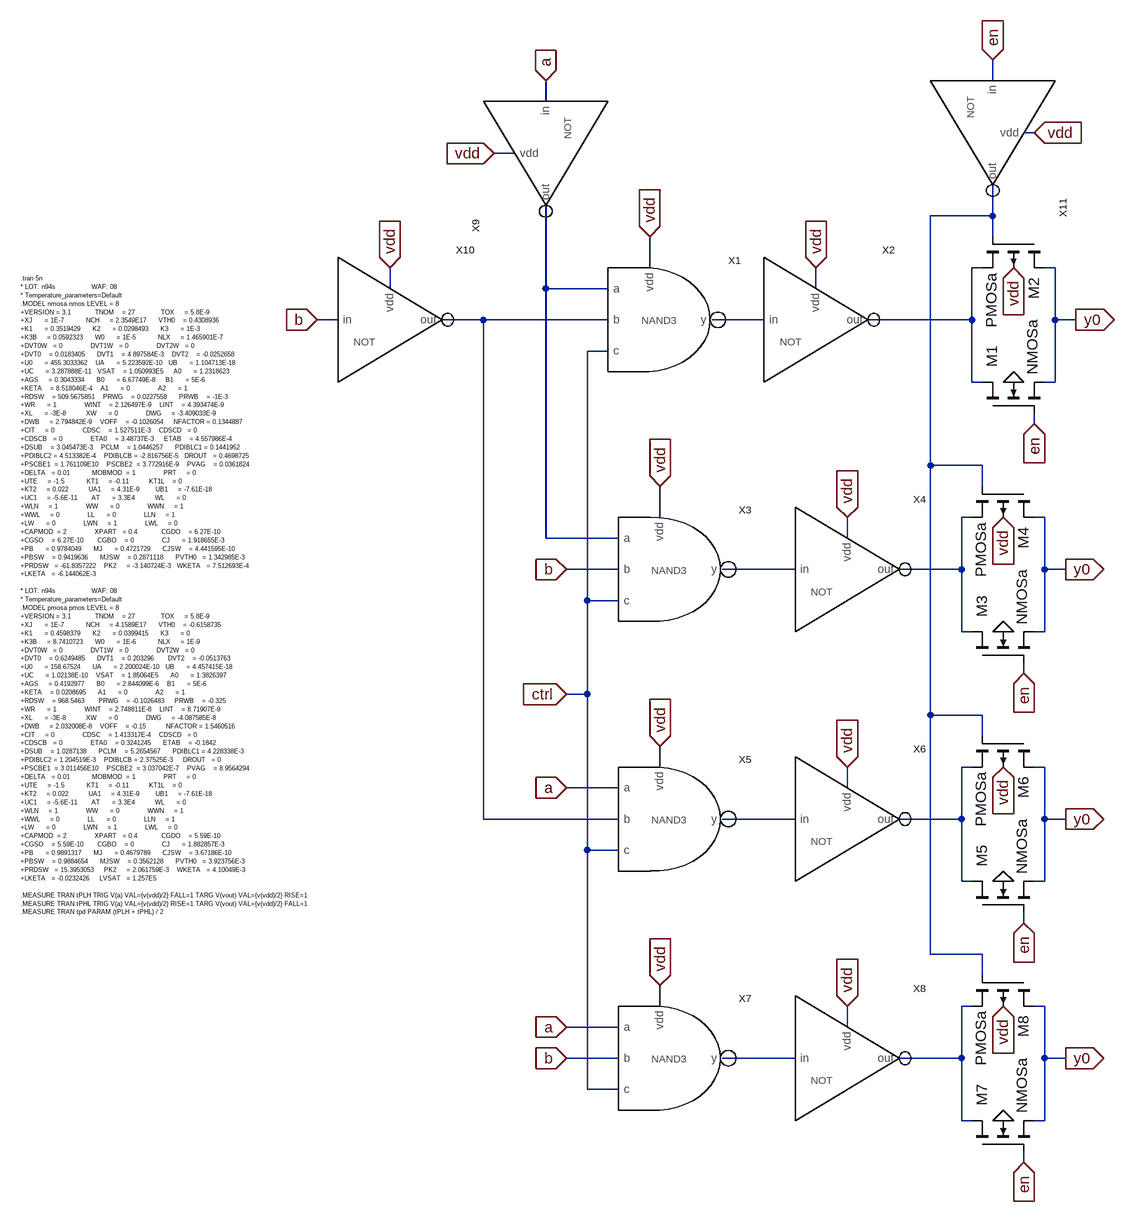
[diagram p0: schematic Demux2-4e.asc]
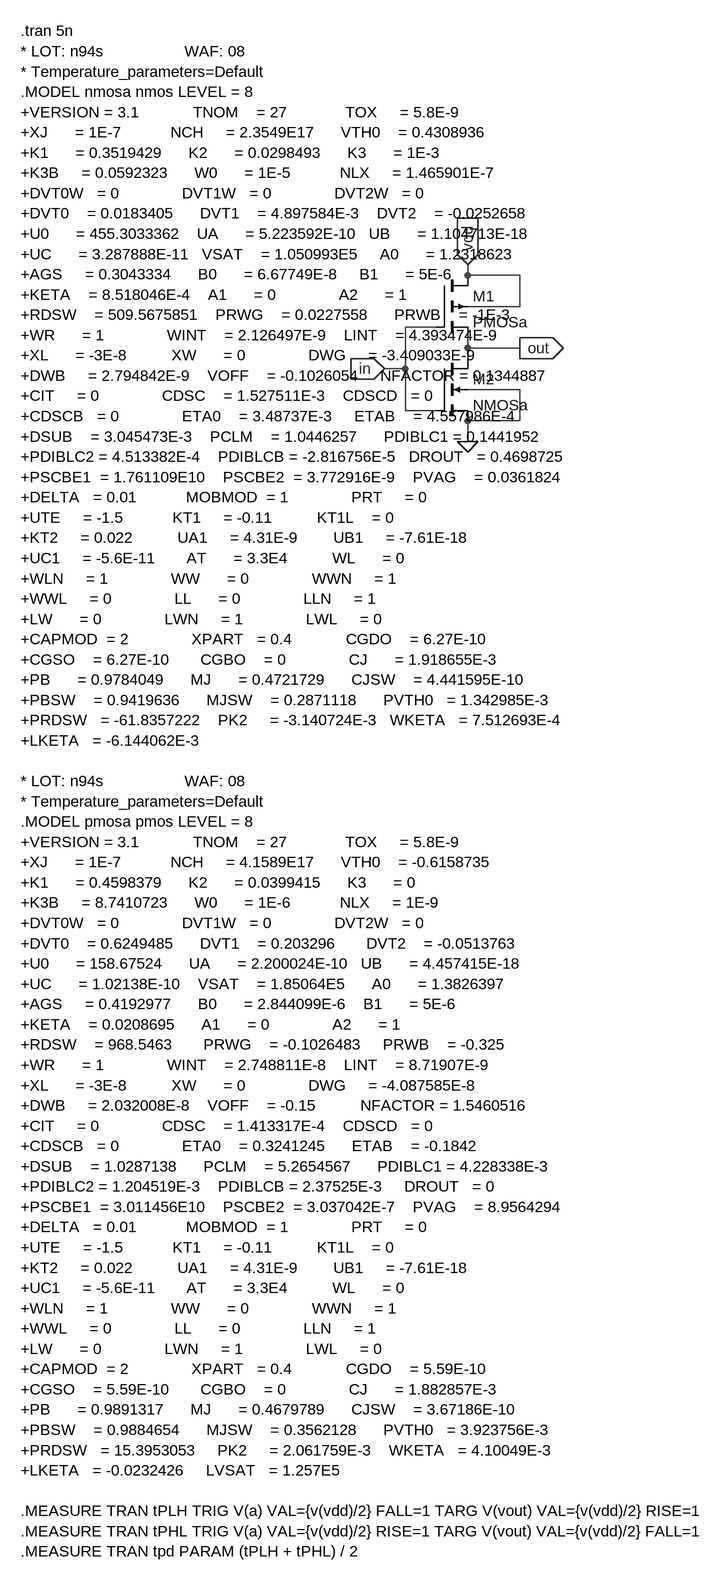
[diagram p1: sub-circuit not.asc]
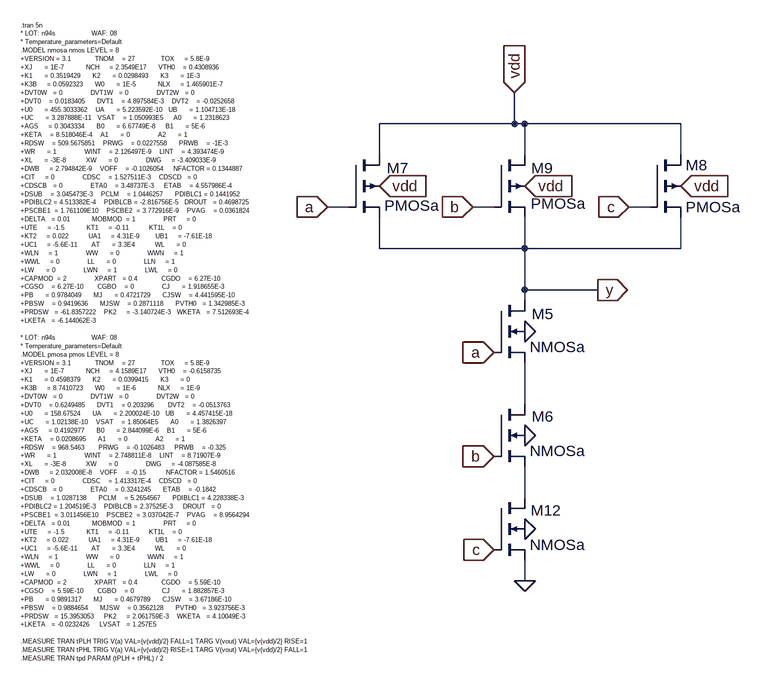
[diagram p2: sub-circuit nand3.asc]
Demux2-4e.asc, the LTspice schematic file:
Version 4.1
SHEET 1 3344 4932
WIRE 1264 -288 1264 -320
WIRE 576 -256 576 -288
WIRE 1328 -208 1312 -208
WIRE 528 -176 496 -176
WIRE 1264 -80 1264 -128
WIRE 1264 -80 1168 -80
WIRE 1264 -48 1264 -80
WIRE 736 0 736 -48
WIRE 1248 0 1232 0
WIRE 1360 0 1344 0
WIRE 336 32 336 0
WIRE 576 32 576 -96
WIRE 672 32 576 32
WIRE 992 32 992 0
WIRE 256 80 224 80
WIRE 480 80 416 80
WIRE 672 80 480 80
WIRE 912 80 832 80
WIRE 1232 80 1232 0
WIRE 1232 80 1072 80
WIRE 1360 80 1360 0
WIRE 1392 80 1360 80
WIRE 672 128 640 128
WIRE 1232 176 1232 80
WIRE 1248 176 1232 176
WIRE 1360 176 1360 80
WIRE 1360 176 1344 176
WIRE 1328 240 1328 224
WIRE 1168 304 1168 -80
WIRE 1248 304 1168 304
WIRE 1248 336 1248 304
WIRE 752 384 752 336
WIRE 1232 384 1216 384
WIRE 1344 384 1328 384
WIRE 576 416 576 32
WIRE 688 416 576 416
WIRE 1040 416 1040 384
WIRE 688 464 608 464
WIRE 960 464 848 464
WIRE 1216 464 1216 384
WIRE 1216 464 1120 464
WIRE 1344 464 1344 384
WIRE 1376 464 1344 464
WIRE 640 512 640 128
WIRE 688 512 640 512
WIRE 1216 560 1216 464
WIRE 1232 560 1216 560
WIRE 1344 560 1344 464
WIRE 1344 560 1328 560
WIRE 1312 624 1312 608
WIRE 640 656 640 512
WIRE 640 656 608 656
WIRE 1168 688 1168 304
WIRE 1248 688 1168 688
WIRE 1248 720 1248 688
WIRE 752 768 752 736
WIRE 1232 768 1216 768
WIRE 1344 768 1328 768
WIRE 688 800 608 800
WIRE 1040 800 1040 768
WIRE 480 848 480 80
WIRE 688 848 480 848
WIRE 960 848 848 848
WIRE 1216 848 1216 768
WIRE 1216 848 1120 848
WIRE 1344 848 1344 768
WIRE 1376 848 1344 848
WIRE 640 896 640 656
WIRE 688 896 640 896
WIRE 1216 944 1216 848
WIRE 1232 944 1216 944
WIRE 1344 944 1344 848
WIRE 1344 944 1328 944
WIRE 1312 1008 1312 992
WIRE 1168 1056 1168 688
WIRE 1248 1056 1168 1056
WIRE 1248 1088 1248 1056
WIRE 752 1136 752 1104
WIRE 1232 1136 1216 1136
WIRE 1344 1136 1328 1136
WIRE 688 1168 608 1168
WIRE 1040 1168 1040 1136
WIRE 688 1216 608 1216
WIRE 960 1216 848 1216
WIRE 1216 1216 1216 1136
WIRE 1216 1216 1120 1216
WIRE 1344 1216 1344 1136
WIRE 1376 1216 1344 1216
WIRE 640 1264 640 896
WIRE 688 1264 640 1264
WIRE 1216 1312 1216 1216
WIRE 1232 1312 1216 1312
WIRE 1344 1312 1344 1216
WIRE 1344 1312 1328 1312
WIRE 1312 1376 1312 1360
FLAG 608 464 b
IOPIN 608 464 In
FLAG 608 800 a
IOPIN 608 800 In
FLAG 608 1168 a
IOPIN 608 1168 In
FLAG 608 1216 b
IOPIN 608 1216 In
FLAG 736 -48 vdd
IOPIN 736 -48 In
FLAG 752 336 vdd
IOPIN 752 336 In
FLAG 752 736 vdd
IOPIN 752 736 In
FLAG 752 1104 vdd
IOPIN 752 1104 In
FLAG 992 0 vdd
IOPIN 992 0 In
FLAG 1392 80 y0
IOPIN 1392 80 Out
FLAG 1040 384 vdd
IOPIN 1040 384 In
FLAG 1040 768 vdd
IOPIN 1040 768 In
FLAG 1040 1136 vdd
IOPIN 1040 1136 In
FLAG 608 656 ctrl
IOPIN 608 656 In
FLAG 496 -176 vdd
IOPIN 496 -176 In
FLAG 576 -288 a
IOPIN 576 -288 In
FLAG 336 0 vdd
IOPIN 336 0 In
FLAG 224 80 b
IOPIN 224 80 In
FLAG 1296 176 0
FLAG 1296 0 vdd
IOPIN 1296 0 In
FLAG 1328 240 en
IOPIN 1328 240 In
FLAG 1328 -208 vdd
IOPIN 1328 -208 In
FLAG 1264 -320 en
IOPIN 1264 -320 In
FLAG 1376 464 y0
IOPIN 1376 464 Out
FLAG 1280 560 0
FLAG 1280 384 vdd
IOPIN 1280 384 In
FLAG 1312 624 en
IOPIN 1312 624 In
FLAG 1376 848 y0
IOPIN 1376 848 Out
FLAG 1280 944 0
FLAG 1280 768 vdd
IOPIN 1280 768 In
FLAG 1312 1008 en
IOPIN 1312 1008 In
FLAG 1376 1216 y0
IOPIN 1376 1216 Out
FLAG 1280 1312 0
FLAG 1280 1136 vdd
IOPIN 1280 1136 In
FLAG 1312 1376 en
IOPIN 1312 1376 In
SYMBOL NOT 992 96 R0
SYMATTR InstName X2
SYMBOL NOT 1040 480 R0
SYMATTR InstName X4
SYMBOL NOT 1040 864 R0
SYMATTR InstName X6
SYMBOL NOT 1040 1232 R0
SYMATTR InstName X8
SYMBOL NAND3 736 80 R0
SYMATTR InstName X1
SYMBOL NAND3 752 464 R0
SYMATTR InstName X3
SYMBOL NAND3 752 848 R0
SYMATTR InstName X5
SYMBOL NAND3 752 1216 R0
SYMATTR InstName X7
SYMBOL NOT 592 -176 M90
SYMATTR InstName X9
SYMBOL NOT 336 96 R0
SYMATTR InstName X10
SYMBOL nmos4 1248 224 R270
WINDOW 0 70 15 Left 2
WINDOW 3 59 77 Left 2
SYMATTR InstName M1
SYMATTR Value NMOSa
SYMATTR Value2 l=180n w=440n
SYMBOL pmos4 1344 -48 R90
WINDOW 0 63 17 Left 2
WINDOW 3 56 82 Left 2
SYMATTR InstName M2
SYMATTR Value PMOSa
SYMATTR Value2 l=180n w=440n
SYMBOL NOT 1248 -208 R90
SYMATTR InstName X11
SYMBOL nmos4 1232 608 R270
WINDOW 0 70 15 Left 2
WINDOW 3 59 77 Left 2
SYMATTR InstName M3
SYMATTR Value NMOSa
SYMATTR Value2 l=180n w=440n
SYMBOL pmos4 1328 336 R90
WINDOW 0 63 17 Left 2
WINDOW 3 56 82 Left 2
SYMATTR InstName M4
SYMATTR Value PMOSa
SYMATTR Value2 l=180n w=440n
SYMBOL nmos4 1232 992 R270
WINDOW 0 70 15 Left 2
WINDOW 3 59 77 Left 2
SYMATTR InstName M5
SYMATTR Value NMOSa
SYMATTR Value2 l=180n w=440n
SYMBOL pmos4 1328 720 R90
WINDOW 0 63 17 Left 2
WINDOW 3 56 82 Left 2
SYMATTR InstName M6
SYMATTR Value PMOSa
SYMATTR Value2 l=180n w=440n
SYMBOL nmos4 1232 1360 R270
WINDOW 0 70 15 Left 2
WINDOW 3 59 77 Left 2
SYMATTR InstName M7
SYMATTR Value NMOSa
SYMATTR Value2 l=180n w=440n
SYMBOL pmos4 1328 1088 R90
WINDOW 0 63 17 Left 2
WINDOW 3 56 82 Left 2
SYMATTR InstName M8
SYMATTR Value PMOSa
SYMATTR Value2 l=180n w=440n
TEXT -232 16 Left 0 !.tran 5n\n* LOT: n94s                  WAF: 08\n* Temperature_parameters=Default\n.MODEL nmosa nmos LEVEL = 8\n+VERSION = 3.1            TNOM    = 27             TOX     = 5.8E-9\n+XJ      = 1E-7           NCH     = 2.3549E17      VTH0    = 0.4308936\n+K1      = 0.3519429      K2      = 0.0298493      K3      = 1E-3\n+K3B     = 0.0592323      W0      = 1E-5           NLX     = 1.465901E-7\n+DVT0W   = 0              DVT1W   = 0              DVT2W   = 0\n+DVT0    = 0.0183405      DVT1    = 4.897584E-3    DVT2    = -0.0252658\n+U0      = 455.3033362    UA      = 5.223592E-10   UB      = 1.104713E-18\n+UC      = 3.287888E-11   VSAT    = 1.050993E5     A0      = 1.2318623\n+AGS     = 0.3043334      B0      = 6.67749E-8     B1      = 5E-6\n+KETA    = 8.518046E-4    A1      = 0              A2      = 1\n+RDSW    = 509.5675851    PRWG    = 0.0227558      PRWB    = -1E-3\n+WR      = 1              WINT    = 2.126497E-9    LINT    = 4.393474E-9\n+XL      = -3E-8          XW      = 0              DWG     = -3.409033E-9\n+DWB     = 2.794842E-9    VOFF    = -0.1026054     NFACTOR = 0.1344887\n+CIT     = 0              CDSC    = 1.527511E-3    CDSCD   = 0\n+CDSCB   = 0              ETA0    = 3.48737E-3     ETAB    = 4.557986E-4\n+DSUB    = 3.045473E-3    PCLM    = 1.0446257      PDIBLC1 = 0.1441952\n+PDIBLC2 = 4.513382E-4    PDIBLCB = -2.816756E-5   DROUT   = 0.4698725\n+PSCBE1  = 1.761109E10    PSCBE2  = 3.772916E-9    PVAG    = 0.0361824\n+DELTA   = 0.01           MOBMOD  = 1              PRT     = 0\n+UTE     = -1.5           KT1     = -0.11          KT1L    = 0\n+KT2     = 0.022          UA1     = 4.31E-9        UB1     = -7.61E-18\n+UC1     = -5.6E-11       AT      = 3.3E4          WL      = 0\n+WLN     = 1              WW      = 0              WWN     = 1\n+WWL     = 0              LL      = 0              LLN     = 1\n+LW      = 0              LWN     = 1              LWL     = 0\n+CAPMOD  = 2              XPART   = 0.4            CGDO    = 6.27E-10\n+CGSO    = 6.27E-10       CGBO    = 0              CJ      = 1.918655E-3\n+PB      = 0.9784049      MJ      = 0.4721729      CJSW    = 4.441595E-10\n+PBSW    = 0.9419636      MJSW    = 0.2871118      PVTH0   = 1.342985E-3\n+PRDSW   = -61.8357222    PK2     = -3.140724E-3   WKETA   = 7.512693E-4\n+LKETA   = -6.144062E-3\n \n* LOT: n94s                  WAF: 08\n* Temperature_parameters=Default\n.MODEL pmosa pmos LEVEL = 8\n+VERSION = 3.1            TNOM    = 27             TOX     = 5.8E-9\n+XJ      = 1E-7           NCH     = 4.1589E17      VTH0    = -0.6158735\n+K1      = 0.4598379      K2      = 0.0399415      K3      = 0\n+K3B     = 8.7410723      W0      = 1E-6           NLX     = 1E-9\n+DVT0W   = 0              DVT1W   = 0              DVT2W   = 0\n+DVT0    = 0.6249485      DVT1    = 0.203296       DVT2    = -0.0513763\n+U0      = 158.67524      UA      = 2.200024E-10   UB      = 4.457415E-18\n+UC      = 1.02138E-10    VSAT    = 1.85064E5      A0      = 1.3826397\n+AGS     = 0.4192977      B0      = 2.844099E-6    B1      = 5E-6\n+KETA    = 0.0208695      A1      = 0              A2      = 1\n+RDSW    = 968.5463       PRWG    = -0.1026483     PRWB    = -0.325\n+WR      = 1              WINT    = 2.748811E-8    LINT    = 8.71907E-9\n+XL      = -3E-8          XW      = 0              DWG     = -4.087585E-8\n+DWB     = 2.032008E-8    VOFF    = -0.15          NFACTOR = 1.5460516\n+CIT     = 0              CDSC    = 1.413317E-4    CDSCD   = 0\n+CDSCB   = 0              ETA0    = 0.3241245      ETAB    = -0.1842\n+DSUB    = 1.0287138      PCLM    = 5.2654567      PDIBLC1 = 4.228338E-3\n+PDIBLC2 = 1.204519E-3    PDIBLCB = 2.37525E-3     DROUT   = 0\n+PSCBE1  = 3.011456E10    PSCBE2  = 3.037042E-7    PVAG    = 8.9564294\n+DELTA   = 0.01           MOBMOD  = 1              PRT     = 0\n+UTE     = -1.5           KT1     = -0.11          KT1L    = 0\n+KT2     = 0.022          UA1     = 4.31E-9        UB1     = -7.61E-18\n+UC1     = -5.6E-11       AT      = 3.3E4          WL      = 0\n+WLN     = 1              WW      = 0              WWN     = 1\n+WWL     = 0              LL      = 0              LLN     = 1\n+LW      = 0              LWN     = 1              LWL     = 0\n+CAPMOD  = 2              XPART   = 0.4            CGDO    = 5.59E-10\n+CGSO    = 5.59E-10       CGBO    = 0              CJ      = 1.882857E-3\n+PB      = 0.9891317      MJ      = 0.4679789      CJSW    = 3.67186E-10\n+PBSW    = 0.9884654      MJSW    = 0.3562128      PVTH0   = 3.923756E-3\n+PRDSW   = 15.3953053     PK2     = 2.061759E-3    WKETA   = 4.10049E-3\n+LKETA   = -0.0232426     LVSAT   = 1.257E5\n \n.MEASURE TRAN tPLH TRIG V(a) VAL={v(vdd)/2} FALL=1 TARG V(vout) VAL={v(vdd)/2} RISE=1\n.MEASURE TRAN tPHL TRIG V(a) VAL={v(vdd)/2} RISE=1 TARG V(vout) VAL={v(vdd)/2} FALL=1\n.MEASURE TRAN tpd PARAM (tPLH + tPHL) / 2

not.asc, the sub-circuit schematic file:
Version 4.1
SHEET 1 1424 808
WIRE -48 48 -48 32
WIRE 32 48 -48 48
WIRE 32 96 32 48
WIRE 32 96 -48 96
WIRE -96 128 -144 128
WIRE -48 160 -48 144
WIRE 32 160 -48 160
WIRE -48 176 -48 160
WIRE -144 192 -144 128
WIRE -144 192 -176 192
WIRE 32 224 -48 224
WIRE -144 256 -144 192
WIRE -96 256 -144 256
WIRE 32 272 32 224
WIRE 32 272 -48 272
WIRE -48 304 -48 272
FLAG -48 304 0
FLAG -48 32 vdd
IOPIN -48 32 In
FLAG -176 192 in
IOPIN -176 192 In
FLAG 32 160 out
IOPIN 32 160 Out
SYMBOL pmos4 -96 48 R0
SYMATTR InstName M1
SYMATTR Value2 l=180n w=880n
SYMATTR Value PMOSa
SYMBOL nmos4 -96 176 R0
SYMATTR InstName M2
SYMATTR Value2 l=180n w=440n
SYMATTR Value NMOSa
TEXT -736 -328 Left 0 !.tran 5n\n* LOT: n94s                  WAF: 08\n* Temperature_parameters=Default\n.MODEL nmosa nmos LEVEL = 8\n+VERSION = 3.1            TNOM    = 27             TOX     = 5.8E-9\n+XJ      = 1E-7           NCH     = 2.3549E17      VTH0    = 0.4308936\n+K1      = 0.3519429      K2      = 0.0298493      K3      = 1E-3\n+K3B     = 0.0592323      W0      = 1E-5           NLX     = 1.465901E-7\n+DVT0W   = 0              DVT1W   = 0              DVT2W   = 0\n+DVT0    = 0.0183405      DVT1    = 4.897584E-3    DVT2    = -0.0252658\n+U0      = 455.3033362    UA      = 5.223592E-10   UB      = 1.104713E-18\n+UC      = 3.287888E-11   VSAT    = 1.050993E5     A0      = 1.2318623\n+AGS     = 0.3043334      B0      = 6.67749E-8     B1      = 5E-6\n+KETA    = 8.518046E-4    A1      = 0              A2      = 1\n+RDSW    = 509.5675851    PRWG    = 0.0227558      PRWB    = -1E-3\n+WR      = 1              WINT    = 2.126497E-9    LINT    = 4.393474E-9\n+XL      = -3E-8          XW      = 0              DWG     = -3.409033E-9\n+DWB     = 2.794842E-9    VOFF    = -0.1026054     NFACTOR = 0.1344887\n+CIT     = 0              CDSC    = 1.527511E-3    CDSCD   = 0\n+CDSCB   = 0              ETA0    = 3.48737E-3     ETAB    = 4.557986E-4\n+DSUB    = 3.045473E-3    PCLM    = 1.0446257      PDIBLC1 = 0.1441952\n+PDIBLC2 = 4.513382E-4    PDIBLCB = -2.816756E-5   DROUT   = 0.4698725\n+PSCBE1  = 1.761109E10    PSCBE2  = 3.772916E-9    PVAG    = 0.0361824\n+DELTA   = 0.01           MOBMOD  = 1              PRT     = 0\n+UTE     = -1.5           KT1     = -0.11          KT1L    = 0\n+KT2     = 0.022          UA1     = 4.31E-9        UB1     = -7.61E-18\n+UC1     = -5.6E-11       AT      = 3.3E4          WL      = 0\n+WLN     = 1              WW      = 0              WWN     = 1\n+WWL     = 0              LL      = 0              LLN     = 1\n+LW      = 0              LWN     = 1              LWL     = 0\n+CAPMOD  = 2              XPART   = 0.4            CGDO    = 6.27E-10\n+CGSO    = 6.27E-10       CGBO    = 0              CJ      = 1.918655E-3\n+PB      = 0.9784049      MJ      = 0.4721729      CJSW    = 4.441595E-10\n+PBSW    = 0.9419636      MJSW    = 0.2871118      PVTH0   = 1.342985E-3\n+PRDSW   = -61.8357222    PK2     = -3.140724E-3   WKETA   = 7.512693E-4\n+LKETA   = -6.144062E-3\n \n* LOT: n94s                  WAF: 08\n* Temperature_parameters=Default\n.MODEL pmosa pmos LEVEL = 8\n+VERSION = 3.1            TNOM    = 27             TOX     = 5.8E-9\n+XJ      = 1E-7           NCH     = 4.1589E17      VTH0    = -0.6158735\n+K1      = 0.4598379      K2      = 0.0399415      K3      = 0\n+K3B     = 8.7410723      W0      = 1E-6           NLX     = 1E-9\n+DVT0W   = 0              DVT1W   = 0              DVT2W   = 0\n+DVT0    = 0.6249485      DVT1    = 0.203296       DVT2    = -0.0513763\n+U0      = 158.67524      UA      = 2.200024E-10   UB      = 4.457415E-18\n+UC      = 1.02138E-10    VSAT    = 1.85064E5      A0      = 1.3826397\n+AGS     = 0.4192977      B0      = 2.844099E-6    B1      = 5E-6\n+KETA    = 0.0208695      A1      = 0              A2      = 1\n+RDSW    = 968.5463       PRWG    = -0.1026483     PRWB    = -0.325\n+WR      = 1              WINT    = 2.748811E-8    LINT    = 8.71907E-9\n+XL      = -3E-8          XW      = 0              DWG     = -4.087585E-8\n+DWB     = 2.032008E-8    VOFF    = -0.15          NFACTOR = 1.5460516\n+CIT     = 0              CDSC    = 1.413317E-4    CDSCD   = 0\n+CDSCB   = 0              ETA0    = 0.3241245      ETAB    = -0.1842\n+DSUB    = 1.0287138      PCLM    = 5.2654567      PDIBLC1 = 4.228338E-3\n+PDIBLC2 = 1.204519E-3    PDIBLCB = 2.37525E-3     DROUT   = 0\n+PSCBE1  = 3.011456E10    PSCBE2  = 3.037042E-7    PVAG    = 8.9564294\n+DELTA   = 0.01           MOBMOD  = 1              PRT     = 0\n+UTE     = -1.5           KT1     = -0.11          KT1L    = 0\n+KT2     = 0.022          UA1     = 4.31E-9        UB1     = -7.61E-18\n+UC1     = -5.6E-11       AT      = 3.3E4          WL      = 0\n+WLN     = 1              WW      = 0              WWN     = 1\n+WWL     = 0              LL      = 0              LLN     = 1\n+LW      = 0              LWN     = 1              LWL     = 0\n+CAPMOD  = 2              XPART   = 0.4            CGDO    = 5.59E-10\n+CGSO    = 5.59E-10       CGBO    = 0              CJ      = 1.882857E-3\n+PB      = 0.9891317      MJ      = 0.4679789      CJSW    = 3.67186E-10\n+PBSW    = 0.9884654      MJSW    = 0.3562128      PVTH0   = 3.923756E-3\n+PRDSW   = 15.3953053     PK2     = 2.061759E-3    WKETA   = 4.10049E-3\n+LKETA   = -0.0232426     LVSAT   = 1.257E5\n \n.MEASURE TRAN tPLH TRIG V(a) VAL={v(vdd)/2} FALL=1 TARG V(vout) VAL={v(vdd)/2} RISE=1\n.MEASURE TRAN tPHL TRIG V(a) VAL={v(vdd)/2} RISE=1 TARG V(vout) VAL={v(vdd)/2} FALL=1\n.MEASURE TRAN tpd PARAM (tPLH + tPHL) / 2

nand3.asc, the sub-circuit schematic file:
Version 4.1
SHEET 1 3344 4932
WIRE 816 16 816 -32
WIRE 816 16 608 16
WIRE 832 16 816 16
WIRE 1072 16 832 16
WIRE 608 64 608 16
WIRE 832 64 832 16
WIRE 1072 64 1072 16
WIRE 560 144 528 144
WIRE 784 144 752 144
WIRE 1024 144 992 144
WIRE 608 208 608 160
WIRE 832 208 832 160
WIRE 832 208 608 208
WIRE 1072 208 1072 160
WIRE 1072 208 832 208
WIRE 832 272 832 208
WIRE 944 272 832 272
WIRE 832 288 832 272
WIRE 832 448 832 384
WIRE 832 592 832 544
WIRE 832 720 832 688
FLAG 832 720 0
FLAG 528 144 a
IOPIN 528 144 In
FLAG 752 144 b
IOPIN 752 144 In
FLAG 992 144 c
IOPIN 992 144 In
FLAG 816 -32 vdd
IOPIN 816 -32 In
FLAG 784 368 a
IOPIN 784 368 In
FLAG 784 528 b
IOPIN 784 528 In
FLAG 784 672 c
IOPIN 784 672 In
FLAG 832 336 0
FLAG 832 496 0
FLAG 832 640 0
FLAG 608 112 vdd
IOPIN 608 112 In
FLAG 832 112 vdd
IOPIN 832 112 In
FLAG 1072 112 vdd
IOPIN 1072 112 In
FLAG 944 272 y
IOPIN 944 272 Out
SYMBOL nmos4 784 288 R0
WINDOW 0 59 21 Left 2
SYMATTR InstName M5
SYMATTR Value2 l=180n w=1320n
SYMATTR Value NMOSa
SYMBOL nmos4 784 448 R0
WINDOW 0 59 19 Left 2
SYMATTR InstName M6
SYMATTR Value2 l=180n w=1320n
SYMATTR Value NMOSa
SYMBOL pmos4 560 64 R0
WINDOW 0 60 20 Left 2
WINDOW 3 56 78 Left 2
SYMATTR InstName M7
SYMATTR Value PMOSa
SYMATTR Value2 l=180n w=880n
SYMBOL pmos4 1024 64 R0
WINDOW 0 56 16 Left 2
WINDOW 3 56 80 Left 2
SYMATTR InstName M8
SYMATTR Value PMOSa
SYMATTR Value2 l=180n w=880n
SYMBOL pmos4 784 64 R0
WINDOW 0 58 20 Left 2
WINDOW 3 57 75 Left 2
SYMATTR InstName M9
SYMATTR Value PMOSa
SYMATTR Value2 l=180n w=880n
SYMBOL nmos4 784 592 R0
WINDOW 0 57 19 Left 2
SYMATTR InstName M12
SYMATTR Value2 l=180n w=1320n
SYMATTR Value NMOSa
TEXT 56 -136 Left 0 !.tran 5n\n* LOT: n94s                  WAF: 08\n* Temperature_parameters=Default\n.MODEL nmosa nmos LEVEL = 8\n+VERSION = 3.1            TNOM    = 27             TOX     = 5.8E-9\n+XJ      = 1E-7           NCH     = 2.3549E17      VTH0    = 0.4308936\n+K1      = 0.3519429      K2      = 0.0298493      K3      = 1E-3\n+K3B     = 0.0592323      W0      = 1E-5           NLX     = 1.465901E-7\n+DVT0W   = 0              DVT1W   = 0              DVT2W   = 0\n+DVT0    = 0.0183405      DVT1    = 4.897584E-3    DVT2    = -0.0252658\n+U0      = 455.3033362    UA      = 5.223592E-10   UB      = 1.104713E-18\n+UC      = 3.287888E-11   VSAT    = 1.050993E5     A0      = 1.2318623\n+AGS     = 0.3043334      B0      = 6.67749E-8     B1      = 5E-6\n+KETA    = 8.518046E-4    A1      = 0              A2      = 1\n+RDSW    = 509.5675851    PRWG    = 0.0227558      PRWB    = -1E-3\n+WR      = 1              WINT    = 2.126497E-9    LINT    = 4.393474E-9\n+XL      = -3E-8          XW      = 0              DWG     = -3.409033E-9\n+DWB     = 2.794842E-9    VOFF    = -0.1026054     NFACTOR = 0.1344887\n+CIT     = 0              CDSC    = 1.527511E-3    CDSCD   = 0\n+CDSCB   = 0              ETA0    = 3.48737E-3     ETAB    = 4.557986E-4\n+DSUB    = 3.045473E-3    PCLM    = 1.0446257      PDIBLC1 = 0.1441952\n+PDIBLC2 = 4.513382E-4    PDIBLCB = -2.816756E-5   DROUT   = 0.4698725\n+PSCBE1  = 1.761109E10    PSCBE2  = 3.772916E-9    PVAG    = 0.0361824\n+DELTA   = 0.01           MOBMOD  = 1              PRT     = 0\n+UTE     = -1.5           KT1     = -0.11          KT1L    = 0\n+KT2     = 0.022          UA1     = 4.31E-9        UB1     = -7.61E-18\n+UC1     = -5.6E-11       AT      = 3.3E4          WL      = 0\n+WLN     = 1              WW      = 0              WWN     = 1\n+WWL     = 0              LL      = 0              LLN     = 1\n+LW      = 0              LWN     = 1              LWL     = 0\n+CAPMOD  = 2              XPART   = 0.4            CGDO    = 6.27E-10\n+CGSO    = 6.27E-10       CGBO    = 0              CJ      = 1.918655E-3\n+PB      = 0.9784049      MJ      = 0.4721729      CJSW    = 4.441595E-10\n+PBSW    = 0.9419636      MJSW    = 0.2871118      PVTH0   = 1.342985E-3\n+PRDSW   = -61.8357222    PK2     = -3.140724E-3   WKETA   = 7.512693E-4\n+LKETA   = -6.144062E-3\n \n* LOT: n94s                  WAF: 08\n* Temperature_parameters=Default\n.MODEL pmosa pmos LEVEL = 8\n+VERSION = 3.1            TNOM    = 27             TOX     = 5.8E-9\n+XJ      = 1E-7           NCH     = 4.1589E17      VTH0    = -0.6158735\n+K1      = 0.4598379      K2      = 0.0399415      K3      = 0\n+K3B     = 8.7410723      W0      = 1E-6           NLX     = 1E-9\n+DVT0W   = 0              DVT1W   = 0              DVT2W   = 0\n+DVT0    = 0.6249485      DVT1    = 0.203296       DVT2    = -0.0513763\n+U0      = 158.67524      UA      = 2.200024E-10   UB      = 4.457415E-18\n+UC      = 1.02138E-10    VSAT    = 1.85064E5      A0      = 1.3826397\n+AGS     = 0.4192977      B0      = 2.844099E-6    B1      = 5E-6\n+KETA    = 0.0208695      A1      = 0              A2      = 1\n+RDSW    = 968.5463       PRWG    = -0.1026483     PRWB    = -0.325\n+WR      = 1              WINT    = 2.748811E-8    LINT    = 8.71907E-9\n+XL      = -3E-8          XW      = 0              DWG     = -4.087585E-8\n+DWB     = 2.032008E-8    VOFF    = -0.15          NFACTOR = 1.5460516\n+CIT     = 0              CDSC    = 1.413317E-4    CDSCD   = 0\n+CDSCB   = 0              ETA0    = 0.3241245      ETAB    = -0.1842\n+DSUB    = 1.0287138      PCLM    = 5.2654567      PDIBLC1 = 4.228338E-3\n+PDIBLC2 = 1.204519E-3    PDIBLCB = 2.37525E-3     DROUT   = 0\n+PSCBE1  = 3.011456E10    PSCBE2  = 3.037042E-7    PVAG    = 8.9564294\n+DELTA   = 0.01           MOBMOD  = 1              PRT     = 0\n+UTE     = -1.5           KT1     = -0.11          KT1L    = 0\n+KT2     = 0.022          UA1     = 4.31E-9        UB1     = -7.61E-18\n+UC1     = -5.6E-11       AT      = 3.3E4          WL      = 0\n+WLN     = 1              WW      = 0              WWN     = 1\n+WWL     = 0              LL      = 0              LLN     = 1\n+LW      = 0              LWN     = 1              LWL     = 0\n+CAPMOD  = 2              XPART   = 0.4            CGDO    = 5.59E-10\n+CGSO    = 5.59E-10       CGBO    = 0              CJ      = 1.882857E-3\n+PB      = 0.9891317      MJ      = 0.4679789      CJSW    = 3.67186E-10\n+PBSW    = 0.9884654      MJSW    = 0.3562128      PVTH0   = 3.923756E-3\n+PRDSW   = 15.3953053     PK2     = 2.061759E-3    WKETA   = 4.10049E-3\n+LKETA   = -0.0232426     LVSAT   = 1.257E5\n \n.MEASURE TRAN tPLH TRIG V(a) VAL={v(vdd)/2} FALL=1 TARG V(vout) VAL={v(vdd)/2} RISE=1\n.MEASURE TRAN tPHL TRIG V(a) VAL={v(vdd)/2} RISE=1 TARG V(vout) VAL={v(vdd)/2} FALL=1\n.MEASURE TRAN tpd PARAM (tPLH + tPHL) / 2

The netlist it stands for:
* Demux2-4e.asc
X§X2 N005 vdd N002 not
X§X4 N007 vdd N006 not
X§X6 N009 vdd N008 not
X§X8 N011 vdd N010 not
X§X1 N003 N004 ctrl vdd N005 nand3
X§X3 N003 b ctrl vdd N007 nand3
X§X5 a N004 ctrl vdd N009 nand3
X§X7 a b ctrl vdd N011 nand3
X§X9 a vdd N003 not
X§X10 b vdd N004 not
M1 N002 en y0 0 NMOSa l=180n w=440n
M2 y0 N001 N002 vdd PMOSa l=180n w=440n
X§X11 en vdd N001 not
M3 N006 en y0 0 NMOSa l=180n w=440n
M4 y0 N001 N006 vdd PMOSa l=180n w=440n
M5 N008 en y0 0 NMOSa l=180n w=440n
M6 y0 N001 N008 vdd PMOSa l=180n w=440n
M7 N010 en y0 0 NMOSa l=180n w=440n
M8 y0 N001 N010 vdd PMOSa l=180n w=440n

* block symbol definitions
.subckt not in vdd out
M1 vdd in out vdd PMOSa l=180n w=880n
M2 out in 0 0 NMOSa l=180n w=440n
.tran 5n
* LOT: n94s                  WAF: 08
* Temperature_parameters=Default
.MODEL nmosa nmos LEVEL = 8
+VERSION = 3.1            TNOM    = 27             TOX     = 5.8E-9
+XJ      = 1E-7           NCH     = 2.3549E17      VTH0    = 0.4308936
+K1      = 0.3519429      K2      = 0.0298493      K3      = 1E-3
+K3B     = 0.0592323      W0      = 1E-5           NLX     = 1.465901E-7
+DVT0W   = 0              DVT1W   = 0              DVT2W   = 0
+DVT0    = 0.0183405      DVT1    = 4.897584E-3    DVT2    = -0.0252658
+U0      = 455.3033362    UA      = 5.223592E-10   UB      = 1.104713E-18
+UC      = 3.287888E-11   VSAT    = 1.050993E5     A0      = 1.2318623
+AGS     = 0.3043334      B0      = 6.67749E-8     B1      = 5E-6
+KETA    = 8.518046E-4    A1      = 0              A2      = 1
+RDSW    = 509.5675851    PRWG    = 0.0227558      PRWB    = -1E-3
+WR      = 1              WINT    = 2.126497E-9    LINT    = 4.393474E-9
+XL      = -3E-8          XW      = 0              DWG     = -3.409033E-9
+DWB     = 2.794842E-9    VOFF    = -0.1026054     NFACTOR = 0.1344887
+CIT     = 0              CDSC    = 1.527511E-3    CDSCD   = 0
+CDSCB   = 0              ETA0    = 3.48737E-3     ETAB    = 4.557986E-4
+DSUB    = 3.045473E-3    PCLM    = 1.0446257      PDIBLC1 = 0.1441952
+PDIBLC2 = 4.513382E-4    PDIBLCB = -2.816756E-5   DROUT   = 0.4698725
+PSCBE1  = 1.761109E10    PSCBE2  = 3.772916E-9    PVAG    = 0.0361824
+DELTA   = 0.01           MOBMOD  = 1              PRT     = 0
+UTE     = -1.5           KT1     = -0.11          KT1L    = 0
+KT2     = 0.022          UA1     = 4.31E-9        UB1     = -7.61E-18
+UC1     = -5.6E-11       AT      = 3.3E4          WL      = 0
+WLN     = 1              WW      = 0              WWN     = 1
+WWL     = 0              LL      = 0              LLN     = 1
+LW      = 0              LWN     = 1              LWL     = 0
+CAPMOD  = 2              XPART   = 0.4            CGDO    = 6.27E-10
+CGSO    = 6.27E-10       CGBO    = 0              CJ      = 1.918655E-3
+PB      = 0.9784049      MJ      = 0.4721729      CJSW    = 4.441595E-10
+PBSW    = 0.9419636      MJSW    = 0.2871118      PVTH0   = 1.342985E-3
+PRDSW   = -61.8357222    PK2     = -3.140724E-3   WKETA   = 7.512693E-4
+LKETA   = -6.144062E-3
* LOT: n94s                  WAF: 08
* Temperature_parameters=Default
.MODEL pmosa pmos LEVEL = 8
+VERSION = 3.1            TNOM    = 27             TOX     = 5.8E-9
+XJ      = 1E-7           NCH     = 4.1589E17      VTH0    = -0.6158735
+K1      = 0.4598379      K2      = 0.0399415      K3      = 0
+K3B     = 8.7410723      W0      = 1E-6           NLX     = 1E-9
+DVT0W   = 0              DVT1W   = 0              DVT2W   = 0
+DVT0    = 0.6249485      DVT1    = 0.203296       DVT2    = -0.0513763
+U0      = 158.67524      UA      = 2.200024E-10   UB      = 4.457415E-18
+UC      = 1.02138E-10    VSAT    = 1.85064E5      A0      = 1.3826397
+AGS     = 0.4192977      B0      = 2.844099E-6    B1      = 5E-6
+KETA    = 0.0208695      A1      = 0              A2      = 1
+RDSW    = 968.5463       PRWG    = -0.1026483     PRWB    = -0.325
+WR      = 1              WINT    = 2.748811E-8    LINT    = 8.71907E-9
+XL      = -3E-8          XW      = 0              DWG     = -4.087585E-8
+DWB     = 2.032008E-8    VOFF    = -0.15          NFACTOR = 1.5460516
+CIT     = 0              CDSC    = 1.413317E-4    CDSCD   = 0
+CDSCB   = 0              ETA0    = 0.3241245      ETAB    = -0.1842
+DSUB    = 1.0287138      PCLM    = 5.2654567      PDIBLC1 = 4.228338E-3
+PDIBLC2 = 1.204519E-3    PDIBLCB = 2.37525E-3     DROUT   = 0
+PSCBE1  = 3.011456E10    PSCBE2  = 3.037042E-7    PVAG    = 8.9564294
+DELTA   = 0.01           MOBMOD  = 1              PRT     = 0
+UTE     = -1.5           KT1     = -0.11          KT1L    = 0
+KT2     = 0.022          UA1     = 4.31E-9        UB1     = -7.61E-18
+UC1     = -5.6E-11       AT      = 3.3E4          WL      = 0
+WLN     = 1              WW      = 0              WWN     = 1
+WWL     = 0              LL      = 0              LLN     = 1
+LW      = 0              LWN     = 1              LWL     = 0
+CAPMOD  = 2              XPART   = 0.4            CGDO    = 5.59E-10
+CGSO    = 5.59E-10       CGBO    = 0              CJ      = 1.882857E-3
+PB      = 0.9891317      MJ      = 0.4679789      CJSW    = 3.67186E-10
+PBSW    = 0.9884654      MJSW    = 0.3562128      PVTH0   = 3.923756E-3
+PRDSW   = 15.3953053     PK2     = 2.061759E-3    WKETA   = 4.10049E-3
+LKETA   = -0.0232426     LVSAT   = 1.257E5
.MEASURE TRAN tPLH TRIG V(a) VAL={v(vdd)/2} FALL=1 TARG V(vout) VAL={v(vdd)/2} RISE=1
.MEASURE TRAN tPHL TRIG V(a) VAL={v(vdd)/2} RISE=1 TARG V(vout) VAL={v(vdd)/2} FALL=1
.MEASURE TRAN tpd PARAM (tPLH + tPHL) / 2
.ends not

.subckt nand3 a b c vdd y
M5 y a N001 0 NMOSa l=180n w=1320n
M6 N001 b N002 0 NMOSa l=180n w=1320n
M7 vdd a y vdd PMOSa l=180n w=880n
M8 vdd c y vdd PMOSa l=180n w=880n
M9 vdd b y vdd PMOSa l=180n w=880n
M12 N002 c 0 0 NMOSa l=180n w=1320n
.tran 5n
* LOT: n94s                  WAF: 08
* Temperature_parameters=Default
.MODEL nmosa nmos LEVEL = 8
+VERSION = 3.1            TNOM    = 27             TOX     = 5.8E-9
+XJ      = 1E-7           NCH     = 2.3549E17      VTH0    = 0.4308936
+K1      = 0.3519429      K2      = 0.0298493      K3      = 1E-3
+K3B     = 0.0592323      W0      = 1E-5           NLX     = 1.465901E-7
+DVT0W   = 0              DVT1W   = 0              DVT2W   = 0
+DVT0    = 0.0183405      DVT1    = 4.897584E-3    DVT2    = -0.0252658
+U0      = 455.3033362    UA      = 5.223592E-10   UB      = 1.104713E-18
+UC      = 3.287888E-11   VSAT    = 1.050993E5     A0      = 1.2318623
+AGS     = 0.3043334      B0      = 6.67749E-8     B1      = 5E-6
+KETA    = 8.518046E-4    A1      = 0              A2      = 1
+RDSW    = 509.5675851    PRWG    = 0.0227558      PRWB    = -1E-3
+WR      = 1              WINT    = 2.126497E-9    LINT    = 4.393474E-9
+XL      = -3E-8          XW      = 0              DWG     = -3.409033E-9
+DWB     = 2.794842E-9    VOFF    = -0.1026054     NFACTOR = 0.1344887
+CIT     = 0              CDSC    = 1.527511E-3    CDSCD   = 0
+CDSCB   = 0              ETA0    = 3.48737E-3     ETAB    = 4.557986E-4
+DSUB    = 3.045473E-3    PCLM    = 1.0446257      PDIBLC1 = 0.1441952
+PDIBLC2 = 4.513382E-4    PDIBLCB = -2.816756E-5   DROUT   = 0.4698725
+PSCBE1  = 1.761109E10    PSCBE2  = 3.772916E-9    PVAG    = 0.0361824
+DELTA   = 0.01           MOBMOD  = 1              PRT     = 0
+UTE     = -1.5           KT1     = -0.11          KT1L    = 0
+KT2     = 0.022          UA1     = 4.31E-9        UB1     = -7.61E-18
+UC1     = -5.6E-11       AT      = 3.3E4          WL      = 0
+WLN     = 1              WW      = 0              WWN     = 1
+WWL     = 0              LL      = 0              LLN     = 1
+LW      = 0              LWN     = 1              LWL     = 0
+CAPMOD  = 2              XPART   = 0.4            CGDO    = 6.27E-10
+CGSO    = 6.27E-10       CGBO    = 0              CJ      = 1.918655E-3
+PB      = 0.9784049      MJ      = 0.4721729      CJSW    = 4.441595E-10
+PBSW    = 0.9419636      MJSW    = 0.2871118      PVTH0   = 1.342985E-3
+PRDSW   = -61.8357222    PK2     = -3.140724E-3   WKETA   = 7.512693E-4
+LKETA   = -6.144062E-3
* LOT: n94s                  WAF: 08
* Temperature_parameters=Default
.MODEL pmosa pmos LEVEL = 8
+VERSION = 3.1            TNOM    = 27             TOX     = 5.8E-9
+XJ      = 1E-7           NCH     = 4.1589E17      VTH0    = -0.6158735
+K1      = 0.4598379      K2      = 0.0399415      K3      = 0
+K3B     = 8.7410723      W0      = 1E-6           NLX     = 1E-9
+DVT0W   = 0              DVT1W   = 0              DVT2W   = 0
+DVT0    = 0.6249485      DVT1    = 0.203296       DVT2    = -0.0513763
+U0      = 158.67524      UA      = 2.200024E-10   UB      = 4.457415E-18
+UC      = 1.02138E-10    VSAT    = 1.85064E5      A0      = 1.3826397
+AGS     = 0.4192977      B0      = 2.844099E-6    B1      = 5E-6
+KETA    = 0.0208695      A1      = 0              A2      = 1
+RDSW    = 968.5463       PRWG    = -0.1026483     PRWB    = -0.325
+WR      = 1              WINT    = 2.748811E-8    LINT    = 8.71907E-9
+XL      = -3E-8          XW      = 0              DWG     = -4.087585E-8
+DWB     = 2.032008E-8    VOFF    = -0.15          NFACTOR = 1.5460516
+CIT     = 0              CDSC    = 1.413317E-4    CDSCD   = 0
+CDSCB   = 0              ETA0    = 0.3241245      ETAB    = -0.1842
+DSUB    = 1.0287138      PCLM    = 5.2654567      PDIBLC1 = 4.228338E-3
+PDIBLC2 = 1.204519E-3    PDIBLCB = 2.37525E-3     DROUT   = 0
+PSCBE1  = 3.011456E10    PSCBE2  = 3.037042E-7    PVAG    = 8.9564294
+DELTA   = 0.01           MOBMOD  = 1              PRT     = 0
+UTE     = -1.5           KT1     = -0.11          KT1L    = 0
+KT2     = 0.022          UA1     = 4.31E-9        UB1     = -7.61E-18
+UC1     = -5.6E-11       AT      = 3.3E4          WL      = 0
+WLN     = 1              WW      = 0              WWN     = 1
+WWL     = 0              LL      = 0              LLN     = 1
+LW      = 0              LWN     = 1              LWL     = 0
+CAPMOD  = 2              XPART   = 0.4            CGDO    = 5.59E-10
+CGSO    = 5.59E-10       CGBO    = 0              CJ      = 1.882857E-3
+PB      = 0.9891317      MJ      = 0.4679789      CJSW    = 3.67186E-10
+PBSW    = 0.9884654      MJSW    = 0.3562128      PVTH0   = 3.923756E-3
+PRDSW   = 15.3953053     PK2     = 2.061759E-3    WKETA   = 4.10049E-3
+LKETA   = -0.0232426     LVSAT   = 1.257E5
.MEASURE TRAN tPLH TRIG V(a) VAL={v(vdd)/2} FALL=1 TARG V(vout) VAL={v(vdd)/2} RISE=1
.MEASURE TRAN tPHL TRIG V(a) VAL={v(vdd)/2} RISE=1 TARG V(vout) VAL={v(vdd)/2} FALL=1
.MEASURE TRAN tpd PARAM (tPLH + tPHL) / 2
.ends nand3

.model NMOS NMOS
.model PMOS PMOS
.lib standard.mos
.tran 5n
* LOT: n94s                  WAF: 08
* Temperature_parameters=Default
.MODEL nmosa nmos LEVEL = 8
+VERSION = 3.1            TNOM    = 27             TOX     = 5.8E-9
+XJ      = 1E-7           NCH     = 2.3549E17      VTH0    = 0.4308936
+K1      = 0.3519429      K2      = 0.0298493      K3      = 1E-3
+K3B     = 0.0592323      W0      = 1E-5           NLX     = 1.465901E-7
+DVT0W   = 0              DVT1W   = 0              DVT2W   = 0
+DVT0    = 0.0183405      DVT1    = 4.897584E-3    DVT2    = -0.0252658
+U0      = 455.3033362    UA      = 5.223592E-10   UB      = 1.104713E-18
+UC      = 3.287888E-11   VSAT    = 1.050993E5     A0      = 1.2318623
+AGS     = 0.3043334      B0      = 6.67749E-8     B1      = 5E-6
+KETA    = 8.518046E-4    A1      = 0              A2      = 1
+RDSW    = 509.5675851    PRWG    = 0.0227558      PRWB    = -1E-3
+WR      = 1              WINT    = 2.126497E-9    LINT    = 4.393474E-9
+XL      = -3E-8          XW      = 0              DWG     = -3.409033E-9
+DWB     = 2.794842E-9    VOFF    = -0.1026054     NFACTOR = 0.1344887
+CIT     = 0              CDSC    = 1.527511E-3    CDSCD   = 0
+CDSCB   = 0              ETA0    = 3.48737E-3     ETAB    = 4.557986E-4
+DSUB    = 3.045473E-3    PCLM    = 1.0446257      PDIBLC1 = 0.1441952
+PDIBLC2 = 4.513382E-4    PDIBLCB = -2.816756E-5   DROUT   = 0.4698725
+PSCBE1  = 1.761109E10    PSCBE2  = 3.772916E-9    PVAG    = 0.0361824
+DELTA   = 0.01           MOBMOD  = 1              PRT     = 0
+UTE     = -1.5           KT1     = -0.11          KT1L    = 0
+KT2     = 0.022          UA1     = 4.31E-9        UB1     = -7.61E-18
+UC1     = -5.6E-11       AT      = 3.3E4          WL      = 0
+WLN     = 1              WW      = 0              WWN     = 1
+WWL     = 0              LL      = 0              LLN     = 1
+LW      = 0              LWN     = 1              LWL     = 0
+CAPMOD  = 2              XPART   = 0.4            CGDO    = 6.27E-10
+CGSO    = 6.27E-10       CGBO    = 0              CJ      = 1.918655E-3
+PB      = 0.9784049      MJ      = 0.4721729      CJSW    = 4.441595E-10
+PBSW    = 0.9419636      MJSW    = 0.2871118      PVTH0   = 1.342985E-3
+PRDSW   = -61.8357222    PK2     = -3.140724E-3   WKETA   = 7.512693E-4
+LKETA   = -6.144062E-3
* LOT: n94s                  WAF: 08
* Temperature_parameters=Default
.MODEL pmosa pmos LEVEL = 8
+VERSION = 3.1            TNOM    = 27             TOX     = 5.8E-9
+XJ      = 1E-7           NCH     = 4.1589E17      VTH0    = -0.6158735
+K1      = 0.4598379      K2      = 0.0399415      K3      = 0
+K3B     = 8.7410723      W0      = 1E-6           NLX     = 1E-9
+DVT0W   = 0              DVT1W   = 0              DVT2W   = 0
+DVT0    = 0.6249485      DVT1    = 0.203296       DVT2    = -0.0513763
+U0      = 158.67524      UA      = 2.200024E-10   UB      = 4.457415E-18
+UC      = 1.02138E-10    VSAT    = 1.85064E5      A0      = 1.3826397
+AGS     = 0.4192977      B0      = 2.844099E-6    B1      = 5E-6
+KETA    = 0.0208695      A1      = 0              A2      = 1
+RDSW    = 968.5463       PRWG    = -0.1026483     PRWB    = -0.325
+WR      = 1              WINT    = 2.748811E-8    LINT    = 8.71907E-9
+XL      = -3E-8          XW      = 0              DWG     = -4.087585E-8
+DWB     = 2.032008E-8    VOFF    = -0.15          NFACTOR = 1.5460516
+CIT     = 0              CDSC    = 1.413317E-4    CDSCD   = 0
+CDSCB   = 0              ETA0    = 0.3241245      ETAB    = -0.1842
+DSUB    = 1.0287138      PCLM    = 5.2654567      PDIBLC1 = 4.228338E-3
+PDIBLC2 = 1.204519E-3    PDIBLCB = 2.37525E-3     DROUT   = 0
+PSCBE1  = 3.011456E10    PSCBE2  = 3.037042E-7    PVAG    = 8.9564294
+DELTA   = 0.01           MOBMOD  = 1              PRT     = 0
+UTE     = -1.5           KT1     = -0.11          KT1L    = 0
+KT2     = 0.022          UA1     = 4.31E-9        UB1     = -7.61E-18
+UC1     = -5.6E-11       AT      = 3.3E4          WL      = 0
+WLN     = 1              WW      = 0              WWN     = 1
+WWL     = 0              LL      = 0              LLN     = 1
+LW      = 0              LWN     = 1              LWL     = 0
+CAPMOD  = 2              XPART   = 0.4            CGDO    = 5.59E-10
+CGSO    = 5.59E-10       CGBO    = 0              CJ      = 1.882857E-3
+PB      = 0.9891317      MJ      = 0.4679789      CJSW    = 3.67186E-10
+PBSW    = 0.9884654      MJSW    = 0.3562128      PVTH0   = 3.923756E-3
+PRDSW   = 15.3953053     PK2     = 2.061759E-3    WKETA   = 4.10049E-3
+LKETA   = -0.0232426     LVSAT   = 1.257E5
.MEASURE TRAN tPLH TRIG V(a) VAL={v(vdd)/2} FALL=1 TARG V(vout) VAL={v(vdd)/2} RISE=1
.MEASURE TRAN tPHL TRIG V(a) VAL={v(vdd)/2} RISE=1 TARG V(vout) VAL={v(vdd)/2} FALL=1
.MEASURE TRAN tpd PARAM (tPLH + tPHL) / 2
.backanno
.end